# EAGLE design main-board-rev1d (EAGLE 7.6.4)
COMPANY: Ekta Labs; COPYRIGHT: 2016; DRAWN: Karl Palsson; REV: A
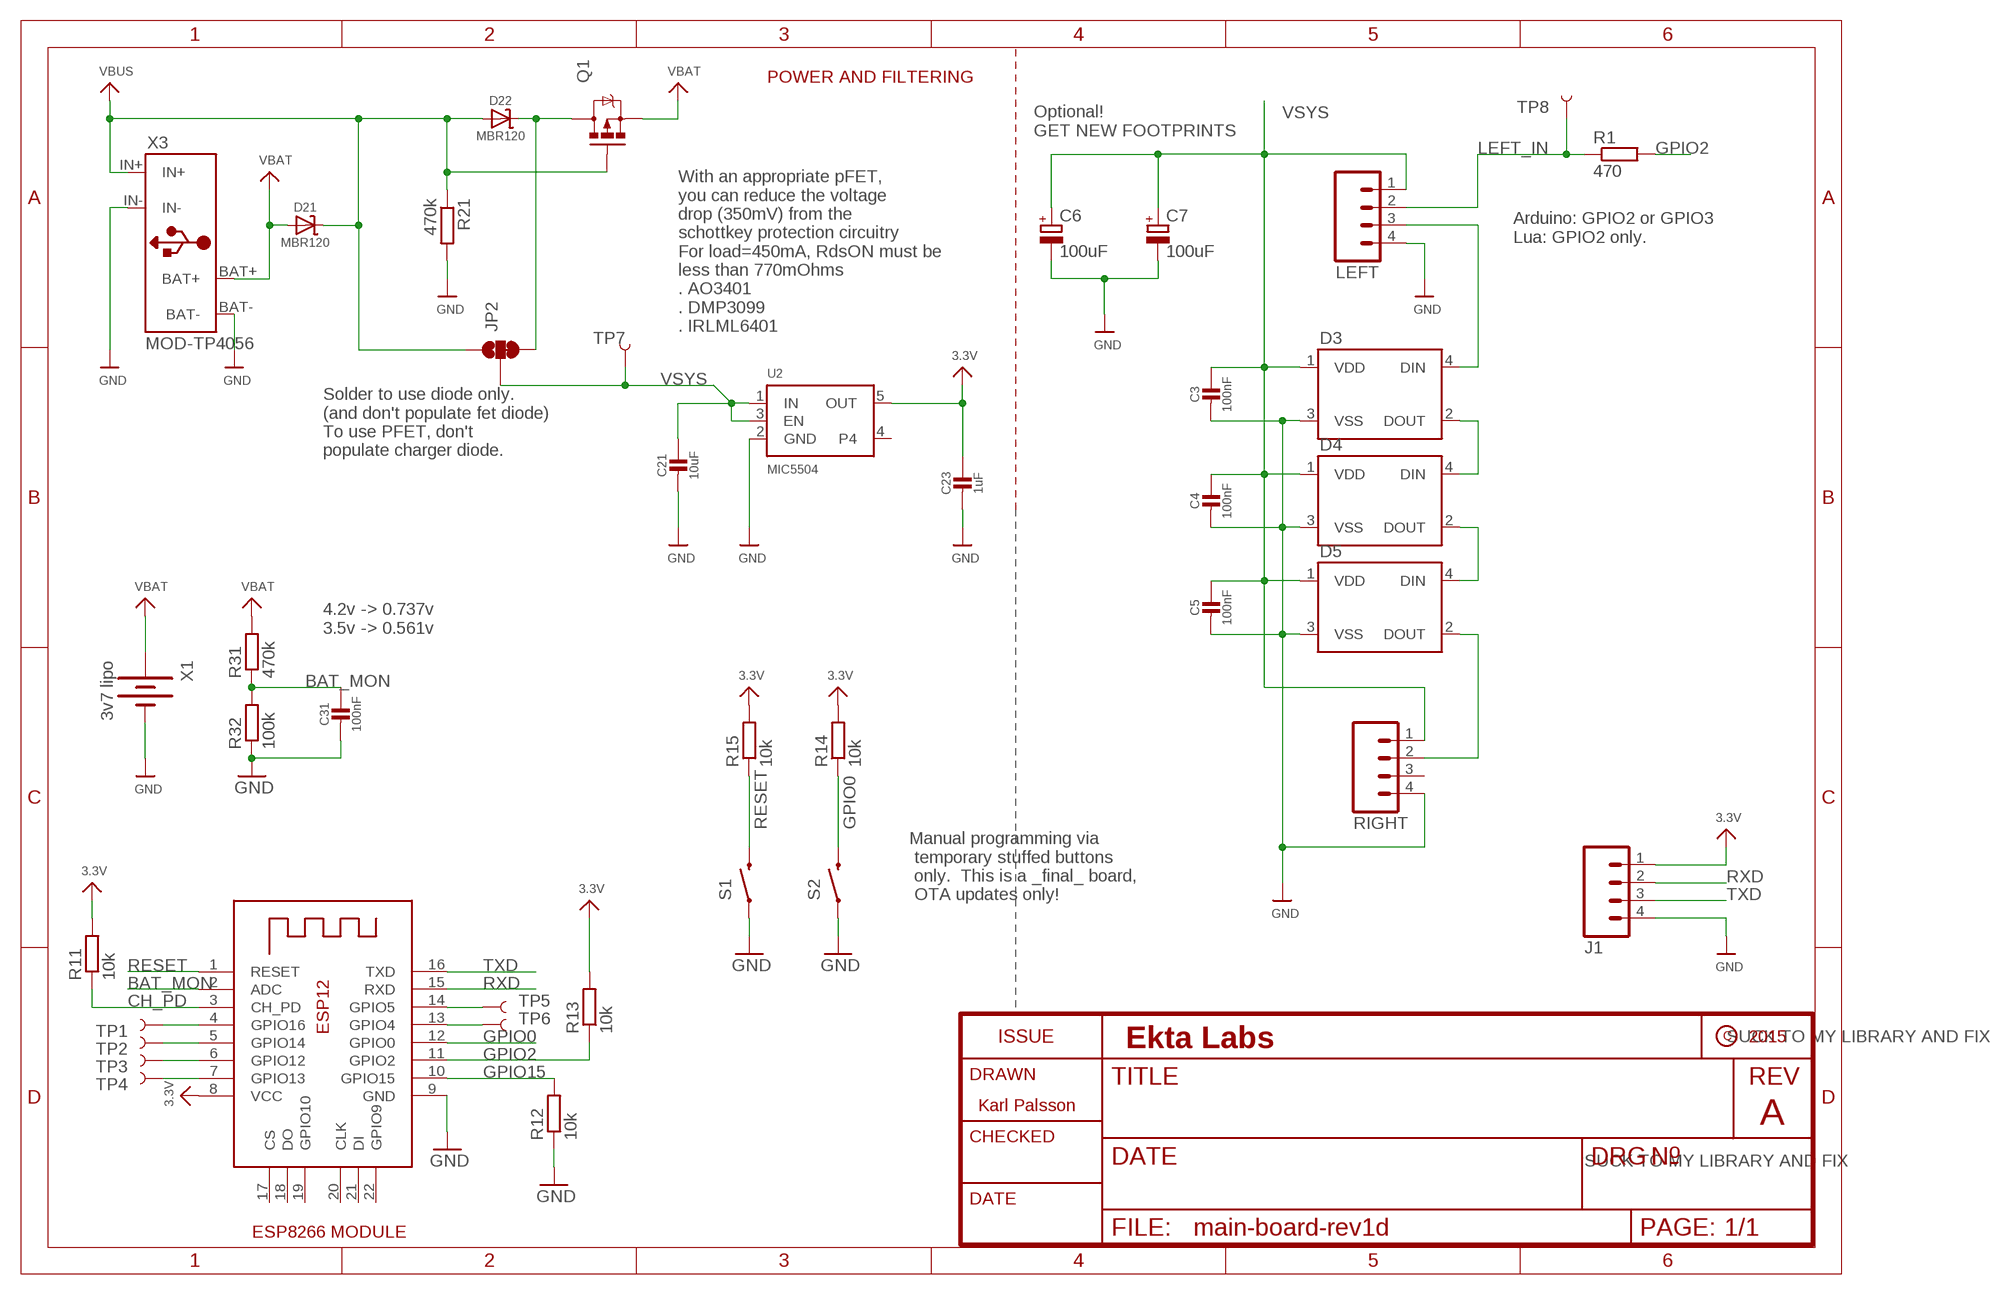
[diagram p0: schematic, sheet 1]

## Parts
C3  100nF  CAP_CERAMIC0805-NOOUTLINE  [0805-NO]
C4  100nF  CAP_CERAMIC0805-NOOUTLINE  [0805-NO]
C5  100nF  CAP_CERAMIC0805-NOOUTLINE  [0805-NO]
C6  100uF  CPOL-EUB  [PANASONIC_B]
C7  100uF  CPOL-EUB  [PANASONIC_B]
C21  10uF  CAP_CERAMIC0805-NOOUTLINE  [0805-NO]
C23  1uF  CAP_CERAMIC0805-NOOUTLINE  [0805-NO]
C31  100nF  CAP_CERAMIC0805-NOOUTLINE  [0805-NO]
D3  WS2812B  [WS2812B]
D4  WS2812B  [WS2812B]
D5  WS2812B  [WS2812B]
D21  MBR120  DIODE-SCHOTTKYSOD-123  [SOD-123]
D22  MBR120  DIODE-SCHOTTKYSOD-123  [SOD-123]
J1  M041X04_NO_SILK  [1X04_NO_SILK]
JP2  JUMPER-PAD-3-2OF3_NC_BY_TRACE_LARGE  [PAD-JUMPER-3-2OF3_NC_BY_TRACE_YES_SILK_LARGE]
LEFT  M041X04_NO_SILK  [1X04_NO_SILK]
Q1  MOSFET-PCHANNEL  [SOT23-3]
R1  470  R-EU_R0603  [R0603]
R11  10k  R-EU_R0603  [R0603]
R12  10k  R-EU_R0603  [R0603]
R13  10k  R-EU_R0603  [R0603]
R14  10k  R-EU_R0603  [R0603]
R15  10k  R-EU_R0603  [R0603]
R21  470k  R-EU_R0603  [R0603]
R31  470k  R-EU_R0603  [R0603]
R32  100k  R-EU_R0603  [R0603]
RIGHT  M041X04_NO_SILK  [1X04_NO_SILK]
S1  SWITCH-MOMENTARY-2PTH  [TACTILE-PTH]
S2  SWITCH-MOMENTARY-2PTH  [TACTILE-PTH]
TP1  TEST-POINTTP_06_TH  [TP_06TH]
TP2  TEST-POINTTP_06_TH  [TP_06TH]
TP3  TEST-POINTTP_06_TH  [TP_06TH]
TP4  TEST-POINTTP_06_TH  [TP_06TH]
TP5  TEST-POINTTP_06_TH  [TP_06TH]
TP6  TEST-POINTTP_06_TH  [TP_06TH]
TP7  TEST-POINTTP_06_TH  [TP_06TH]
TP8  TEST-POINTTP_06_TH  [TP_06TH]
U2  MIC5504  VREG_SOT23-5  [SOT23-5]
X1  3v7 lipo  BATTERY18650-BLOSSOM  [BATT-18650-BLOSSOM-1]
X2  ESP-12  ESP-12E  [ESP-12E]
X3  MOD-TP4056  MOD-LIPO_CHARGER  [MOD-LIPO_CHARGER]

## Nets
3.3V: C23.1 J1.1 R11.2 R13.2 R14.2 R15.2 U2.5(OUT) X2.8(VCC)
BAT_MON: C31.1 R31.1 R32.2 X2.2(ADC)
CH_PD: R11.1 X2.3(CH_PD)
D3_IN: D3.4(DIN) LEFT.3
D4_IN: D3.2(DOUT) D4.4(DIN)
D5_IN: D4.2(DOUT) D5.4(DIN)
GND: C3.2 C4.2 C5.2 C6.- C7.- C21.2 C23.2 C31.2 D3.3(VSS) D4.3(VSS) D5.3(VSS) J1.4 LEFT.4 R12.1 R21.2 R32.1 RIGHT.4 S1.1 S2.1 U2.2(GND) X1.- X2.9(GND) X3.BAT- X3.IN-
GPIO0: R14.1 S2.3 X2.12(GPIO0)
GPIO2: R1.2 R13.1 X2.11(GPIO2)
GPIO15: R12.2 X2.10(GPIO15)
LEFT_IN: LEFT.2 R1.1 TP8.P$1
N$1: TP1.P$1 X2.4(GPIO16)
N$2: TP2.P$1 X2.5(GPIO14)
N$3: D22.C JP2.3 Q1.3(D)
N$4: TP3.P$1 X2.6(GPIO12)
N$5: TP4.P$1 X2.7(GPIO13)
N$6: TP5.P$1 X2.14(GPIO5)
N$7: TP6.P$1 X2.13(GPIO4)
RESET: R15.1 S1.3 X2.1(RESET)
RIGHT_IN: D5.2(DOUT) RIGHT.2
RXD: J1.2 X2.15(RXD)
TXD: J1.3 X2.16(TXD)
VBAT: D21.A Q1.2(S) R31.2 X1.+ X3.BAT+
VBUS: D21.C D22.A JP2.1 Q1.1(G) R21.1 X3.IN+
VSYS: C3.1 C4.1 C5.1 C6.+ C7.+ C21.1 D3.1(VDD) D4.1(VDD) D5.1(VDD) JP2.2 LEFT.1 RIGHT.1 TP7.P$1 U2.1(IN) U2.3(EN)
Unconnected: RIGHT.3 U2.4 X2.17(CS) X2.18(DO) X2.19(GPIO10) X2.20(CLK) X2.21(DI) X2.22(GPIO9)

## Notes on the sheet
- POWER AND FILTERING
- Optional!
  GET NEW FOOTPRINTS
- Arduino: GPIO2 or GPIO3
  Lua: GPIO2 only.
- With an appropriate pFET,
  you can reduce the voltage
  drop (350mV) from the
  schottkey protection circuitry
  For load=450mA, RdsON must be
  less than 770mOhms
  . AO3401
  . DMP3099
  . IRLML6401
- Solder to use diode only.
  (and don't populate fet diode)
  To use PFET, don't 
  populate charger diode.
- 4.2v -> 0.737v
  3.5v -> 0.561v
- Manual programming via
   temporary stuffed buttons
   only.  This is a _final_ board,
   OTA updates only!
- SUCK TO MY LIBRARY AND FIX
- SUCK TO MY LIBRARY AND FIX
- ESP8266 MODULE

## Library data of the parts
C3-C5 C21 C23 C31 = microbuilder:CAP_CERAMIC: Ceramic Capacitors For new designs, use the packages preceded by an '_' character since they are more reliable: The following footprints should be used on most boards: _0402 - Standard footprint for regular board layouts _0603 - Standard footprint for regular board layouts _0805 - Standard footprint for regular board layouts _1206 - Standard footprint for regular board layouts For extremely tight-pitch boards where space is at a premium, the following 'micro-pitch' footprints can be used (smaller pads, no silkscreen outline, etc.): _0402MP - Micro-pitch footprint for very dense/compact boards _0603MP - Micro-pitch footprint for very dense/compact boards _0805MP - Micro-pitch footprint for very dense/compact boards _1206MP - Micro-pitch footprint for very dense/compact boards
C6 C7 = rcl:CPOL-EU: POLARIZED CAPACITOR, European symbol
D3-D5 = karls-parts-2016-09:WS2812B: WS2812B - Intelligent control LED integrated light source Technical Specifications: Power Supply Voltage (VDD): 3.5 to 5.3 V Input Voltage (VI): -0.5 to VDD+0.5 V Operating Junction Temperature (Topt): -25°C to +80°C Storage Temperature Range (Tstg): -55°C to +150°C; PROD_ID: DIO-12503
D21 D22 = microbuilder:DIODE-SCHOTTKY
J1 LEFT RIGHT = SparkFun-Connectors:M04: Header 4 Standard 4-pin 0.1" header. Use with straight break away headers (SKU : PRT-00116), right angle break away headers (PRT-00553), swiss pins (PRT-00743), machine pins (PRT-00117), and female headers (PRT-00115). Molex polarized connector foot print use with SKU : PRT-08231 with associated crimp pins and housings. 1MM SMD Version SKU: PRT-10208; PROD_ID: CONN-09696
JP2 = SparkFun-Passives:JUMPER-PAD-3-2OF3_NC_BY_TRACE
Q1 = SparkFun-DiscreteSemi:MOSFET-PCHANNEL: Generic PMOSFET IRLML2244 - TRANS-11153 (SOT-23 -20V -4.3A) (1.Gate 2.Source 3.Drain) FQP27P06 - COM-10349 <http://www.sparkfun.com/products/10349> (TO-220 -60V -27A) (1.Gate 2.Source 3.Drain); PROD_ID: TRANS-08285
R1 R11-R15 R21 R31 R32 = resistor:R-EU_: RESISTOR, European symbol
S1 S2 = SparkFun-Electromechanical:SWITCH-MOMENTARY-2: Various NO switches- pushbuttons, reed, etc; PROD_ID: SWCH-08441
TP1-TP8 = karls-parts-2016-09:TEST-POINT: Bare copper test points for troubleshooting or ICT
U2 = microbuilder:VREG_SOT23-5: SOT23-5 Fixed Voltage Regulators Part Current Out V Out V In V Dropout θJA (°C/W) TJ (°C) Digikey Part No. ADP121 150mA 3.3V 3.4-5.5V 0.09V @ 150mA -- -- ADP121-AUJZ33R7CT-ND ADP121 150mA 3.0V 3.1-5.5V 0.09V @ 150mA -- -- ADP121-AUJZ30R7CT-ND ADP122 300mA 3.3V 3.4-5.5V 0.085V @ 300mA -- -- ADP122AUJZ-3.3-R7CT-ND ADP1712 300mA 3.3V 3.5-5.5V 0.17V @ 300mA -- -- ADP1712AUJZ-3.3-R7TR-ND AP7311 (Low Cost) 150mA 3.3V 3.5-6V 0.15V @ 150mA -- -- AP7311-33WG-7DICT-ND LD39015M18R 150mA 1.8V 1.9V-5.5V 0.08V @ 100mA -- -- 497-6977-1-ND LP2985A-33DBVR 150mA 3.3V 3.3-16V 0.28V @ 150mA 206 150 296-18479-1-ND MCP1824T-3302E/OT 300mA 3.3V 3.5V-6V 0.2V @ 300mA -- -- MCP1824T-3302E/OTCT-ND MIC5205-2.5YM5 TR 150mA 2.5V 2.7-16V 0.165V @ 150mA -- -- 576-1257-2-ND MIC5205-3.0YM5 TR 150mA 3.0V 3.2V-16V 0.165V @ 150mA -- -- 576-1258-2-ND MIC5205-3.3YM5 TR 150mA 3.3V 3.5V-16V 0.165V @ 150mA -- -- 576-1259-2-ND TPS780330220 150mA 3.3V+2.2V 3.6-5.5V 250mV Max -- -- 296-23332-1-ND TDA3663/N1,135 100mA 3.3V 3.5-45V 0.18V @ 50mA -- -- 568-5343-1-ND Max operating temp can be calculated using θJA, TJ (max junction temperature), and power in watts. Set the "Maximum Ambient Temperature" until it reaches TJ ("Max Junction Temperature"), which is the absolute limit for safe use of the regulator: Heat Sink Temperature Calculator <http://www.daycounter.com/Calculators/Heat-Sink-Temperature-Calculator.phtml> For example, With 12V source into a 3.3V LP2985 and a 30mA load, we are dissipating (12V-3.3V) * 0.03A = 0.261W. With a θJA of 206 °C/W, a TJ of 150°C, and 261mW we can safely use the chip without a heat sink up to 75°C (=147.1°C Junction Temperature).
X1 = karls-parts-2016-09:BATTERY
X2 = microbuilder:ESP-12E
X3 = karls-parts-2016-09:MOD-LIPO_CHARGER: TP4056 USB Battery Charger module

## Board
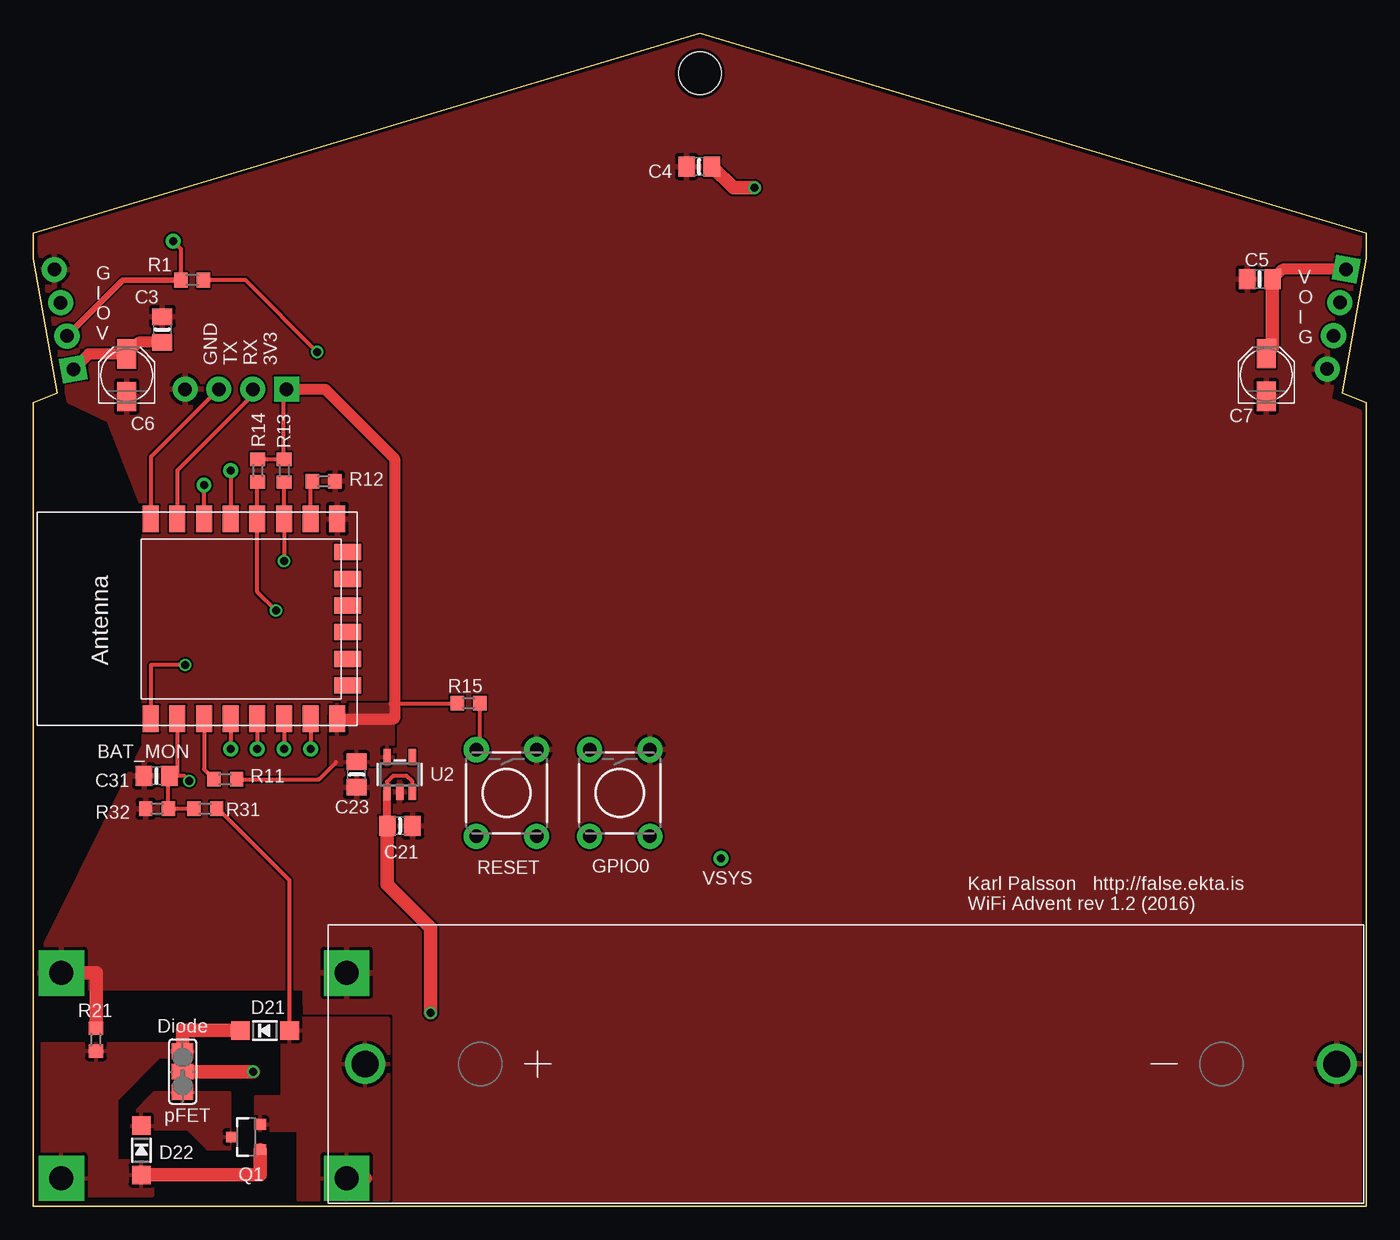
[diagram p1: board, top side]
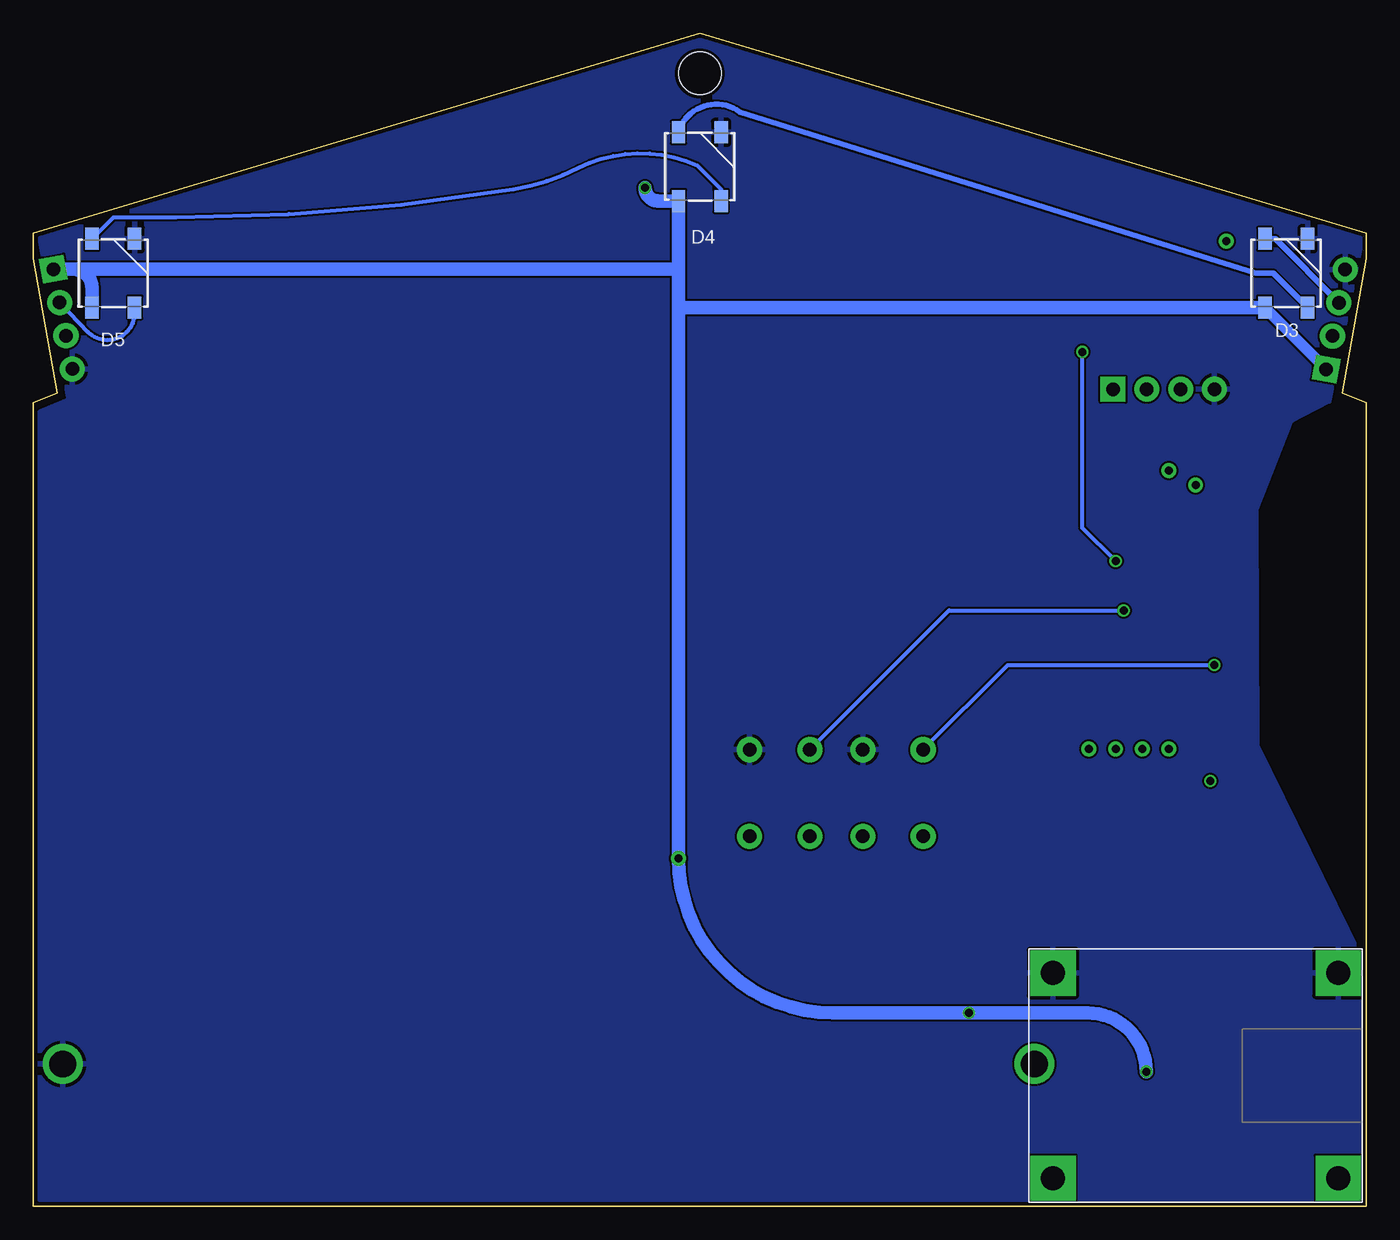
[diagram p2: board, bottom side, seen from below]

Size 100 x 88 mm. Coordinates in mm from the lower left corner, seen from the top.
Outline: 0,8.89 0,2.54
Outline: 0,0 100,0 100,60.3 98.2,61 100,71.1 100,73 50,88 0,73 0,71.1 1.8,61 0,60.3 0,0
Copper layers (1*16): Top 0.035mm / dielectric 1.5mm / Bottom 0.035mm
Design rules "SeeedStudio_2layer_DRU_no_angle_20140221": minimum track width 6mil, minimum drill 12mil, track to track 6mil, track to pad 6mil, pad to pad 6mil, via to via 6mil, smd to smd 0mil, copper to edge 10mil, drill to drill 10mil, minimum pad ring 10mil, minimum via ring 6mil, stop-mask expansion 2mil, vias tented up to drill 100mil, thermal gap 10mil
Holes 3.2 mm at 50,85

### Footprints (pad centres in the part's own frame; a part is rotated, then mirrored left to right if it is on the bottom)
0805-NO = smd 1.24 x 1.5: 1 -0.95,0; 2 0.95,0
PANASONIC_B = smd 2.2 x 1.4: + 1.6,0; - -1.6,0
WS2812B = smd 1.651 x 1: 1 -2.577,1.6; 2 -2.577,-1.6; 3 2.577,-1.6; 4 2.577,1.6
SOD-123 = smd 1.4 x 1.4: A 1.85,0; C -1.85,0
1X04_NO_SILK = drill 1.016 pad 1.88 square: 1 0,0 | drill 1.016 pad 1.88: 2 2.54,0; 3 5.08,0; 4 7.62,0
PAD-JUMPER-3-2OF3_NC_BY_TRACE_YES_SILK_LARGE = smd 1.168 x 1.6: 1 -1.524,0; 2 0,0; 3 1.524,0
SOT23-3 = smd 0.8 x 0.9: 1 -0.95,-1; 2 0.95,-1; 3 0,1.1
R0603 = smd 1 x 1.1: 1 -0.85,0; 2 0.85,0
TACTILE-PTH = drill 1.016 pad 1.88: 1 -3.251,2.261; 2 3.251,2.261; 3 -3.251,-2.261; 4 3.251,-2.261
TP_06TH = drill 0.6: P$1 0,0
SOT23-5 = smd 0.55 x 1.2: 1 -0.95,-1.3; 2 0,-1.3; 3 0.95,-1.3; 4 0.95,1.3; 5 -0.95,1.3
BATT-18650-BLOSSOM-1 = drill 2: + 36.45,0; - -36.45,0
ESP-12E = smd 2 x 1.2: 1 -7.5,5.77; 2 -7.5,3.77; 3 -7.5,1.77; 4 -7.5,-0.23; 5 -7.5,-2.23; 6 -7.5,-4.23; 7 -7.5,-6.23; 8 -7.5,-8.23; 9 7.5,-8.23; 10 7.5,-6.23; 11 7.5,-4.23; 12 7.5,-2.23; 13 7.5,-0.23; 14 7.5,1.77; 15 7.5,3.77; 16 7.5,5.77 | smd 1.2 x 2: 17 -5,-9; 18 -3,-9; 19 -1,-9; 20 1,-9; 21 3,-9; 22 5,-9
MOD-LIPO_CHARGER = drill 1.8 pad 3.4 square: BAT+ 7.2,-10.2; BAT- -8.2,-10.2; IN+ 7.2,11.2; IN- -8.2,11.2

### Placement (x,y rotation side)
C3  9.68,65.78 90 top
C4  49.96,78 180 top
C5  92.02,69.56 180 top
C6  7,62.34 90 top
C7  92.5,62.37 90 top
C21  27.5,28.54 0 top
C23  24.24,32.38 270 top
C31  9.25,32.3 180 top
D3  6,70 90 bottom
D4  50,78 90 bottom
D5  94,70 90 bottom
D21  17.38,13.18 0 top
D22  8.1,4.2 270 top
J1  19,61.3 180 top
JP2  11.2,10.1 270 top
LEFT  3,62.8 79.2 bottom
Q1  16,5.2 90 top
R1  11.91,69.48 0 top
R11  14.4,32.03 0 top
R12  21.78,54.4 180 top
R13  18.82,55.18 90 top
R14  16.83,55.2 90 top
R15  32.65,37.75 180 top
R21  4.7,12.5 90 top
R31  12.9,29.82 0 top
R32  9.28,29.82 0 top
RIGHT  98.5,70.3 259.2 top
S1  35.5,31 270 top
S2  44,31 270 top
TP1  14.8,34.3 0 top
TP2  16.8,34.3 0 top
TP3  18.8,34.3 0 top
TP4  20.8,34.3 0 top
TP5  12.8,54.1 0 top
TP6  14.8,55.2 0 top
TP7  51.6,26.1 0 top
TP8  10.5,72.4 0 top
U2  27.49,32.39 0 top
X1  61.34,10.67 180 top
X2  14.58,44.07 90 top
X3  13.3,9.3 270 bottom

### Tracks (layer width: path | path; a pad name or v marks a point on that pad's centre or on a via)
3.3V
  Top 0.305: R11.2 21.43,32.03 22.7,33.3 | R14.2 18.8,56.05 | 18.8,56.05 R13.2 | 18.8,56.05 18.8,61.1 J1.1 | R15.2 31.75,37.7 27.1,37.7
  Top 0.813: 22.7,36.46 X2.8 27.1,36.57 27.1,37.7 27.1,56.1 21.9,61.3 J1.1
  pour Top: 27,33.2 27,37.6 26.2,37.6 22.3,37.6 22.3,33.2
BAT_MON  (via drill 0.6)
  Top 0.305: X2.2 10.81,32.3 | 10.81,32.3 C31.1 10.13,32.3 R32.2 R31.1 | v11.7,31.9 11.3,32.3 10.81,32.3
CH_PD
  Top 0.305: X2.3 12.81,32.77 R11.1
D3_IN
  Bottom 0.406: D3.4 6.83,72.58 LEFT.3
D4_IN
  Bottom 0.406: D4.4 arc110 47,82.1 8.3,70 6.98,70 D3.2
D5_IN
  Bottom 0.305: D5.4 93.98,74.2 89.3,74.2 arc-9 64,76.3 arc-17 59.1,77.9 arc51 50.2,78.1 48.4,76.3 D4.2
GND
  Top 1.016: X3.IN- 4.7,17.5 R21.2
  pour Bottom (rank 4): 0.5,0.5 99.5,0.5 99.5,59.6 97.3,60.5 99.5,72.6 50,87.5 0.4,72.7 0.4,72.2 2.8,60.4 5.7,58.9 8.3,52.3 8.2,34.6 0.4,18.7
  pour Top (rank 4): 20.6,0.5 99.5,0.5 99.5,59.6 97.2,60.5 99.6,72.6 50,87.5 0.4,72.7 0.4,72.3 2.7,60.4 5.7,59 8.3,52.3 8.3,34.6 0.4,18.6 0.4,16.4 20.4,16.4
GPIO0  (via drill 0.6)
  Top 0.305: v18.2,44.7 16.81,46.09 X2.12 16.81,54.32 R14.1
  Bottom 0.305: S2.3 31.29,44.7 v18.2,44.7
GPIO2  (via drill 0.6)
  Top 0.305: v18.8,48.4 X2.11 18.81,54.31 R13.1 | v21.3,64.1 15.92,69.48 R1.2
  Bottom 0.305: v18.8,48.4 21.3,50.9 v21.3,64.1
GPIO15
  Top 0.305: X2.10 20.81,54.28 R12.2
LEFT_IN
  Top 0.305: TP8.P$1 11.06,71.83 R1.1
  Top 0.406: LEFT.2 6.71,69.48 R1.1
N$1
  Top 0.305: X2.4 TP1.P$1
N$2
  Top 0.305: X2.5 TP2.P$1
N$3
  pour Top: 11.2,8.5 14.7,8.5 14.7,4.3 13.1,4.3 11.6,5.8 7.4,5.8 7.4,6.8 9.1,8.5 10.3,8.5
N$4
  Top 0.305: X2.6 TP3.P$1
N$5
  Top 0.305: X2.7 TP4.P$1
N$6
  Top 0.305: X2.14 TP5.P$1
N$7
  Top 0.305: TP6.P$1 X2.13
RESET  (via drill 0.6)
  Top 0.305: 8.4,36.16 X2.1 8.81,40.6 v11.4,40.6 | S1.3 33.5,34.51 R15.1
  Bottom 0.305: S1.3 26.89,40.6 v11.4,40.6
RIGHT_IN
  Bottom 0.305: RIGHT.2 95.9,65.6 arc-145 D5.2
RXD
  Top 0.305: J1.2 16.46,60.86 10.81,55.21 X2.15
TXD
  Top 0.305: J1.3 8.81,56.19 X2.16
VBAT
  Top 0.305: D21.A 19.23,24.44 13.85,29.82 R31.2
  Top 1.016: 24.89,2.1 X3.BAT+
  pour Top: 18.7,14.1 26.6,14.1 26.6,0.5 19.9,0.5 19.9,5.7 16.7,5.7 16.7,8.2 18.7,8.2 18.7,11
VBUS
  Top 1.016: Q1.1 17,2.35 D22.A | D21.C 11.2,13.18 JP2.1
  pour Top: 8.9,3.3 8.9,0.8 0.7,0.8 0.7,12.2 11.9,12.2 11.9,11.2 9.4,11.2 6.2,8 6.2,4 6.2,3.4 7.1,3.4
VSYS  (via drill 0.6)
  Top 0.305: U2.3 28.44,31.86 28,32.3 27,32.3 26.54,31.84 U2.1
  Top 0.61: C21.1 U2.1
  Top 0.813: RIGHT.1 93.71,70.3 C5.1 | LEFT.1 4.14,63.94 C6.+ 7.89,64.83 C3.1
  Top 1.016: C7.+ 92.97,64.43 C5.1 | C4.1 52.51,76.4 v54.1,76.4 | JP2.2 v16.5,10.1 | C21.1 26.55,24.15 29.8,20.9 v29.8,14.5
  Bottom 0.813: D3.1 7.6,67.4 LEFT.1
  Bottom 1.016: 97,70.3 RIGHT.1 | D5.1 95.6,68.9 arc-90 97,70.3 | 51.6,70.3 D4.1 53.12,75.42 arc90 v54.1,76.4 | 51.6,70.3 51.6,67.5 | 51.6,67.5 TP7.P$1 arc-90 40,14.5 v29.8,14.5 20.9,14.5 arc90 v16.5,10.1 | 51.6,70.3 97,70.3 | D3.1 51.52,67.42 51.6,67.5

### Text on the board
tPlace: G / I / O / V | V / O / I / G | GND / TX / RX / 3V3 | BAT_MON | RESET | GPIO0 | VSYS | Karl Palsson http://false.ekta.is / WiFi Advent rev 1.2 (2016) | Diode | pFET